# Altium schematic sheet Digital_Inputs.SchDoc
size A4; SheetNumber: 4; SheetTotal: 6
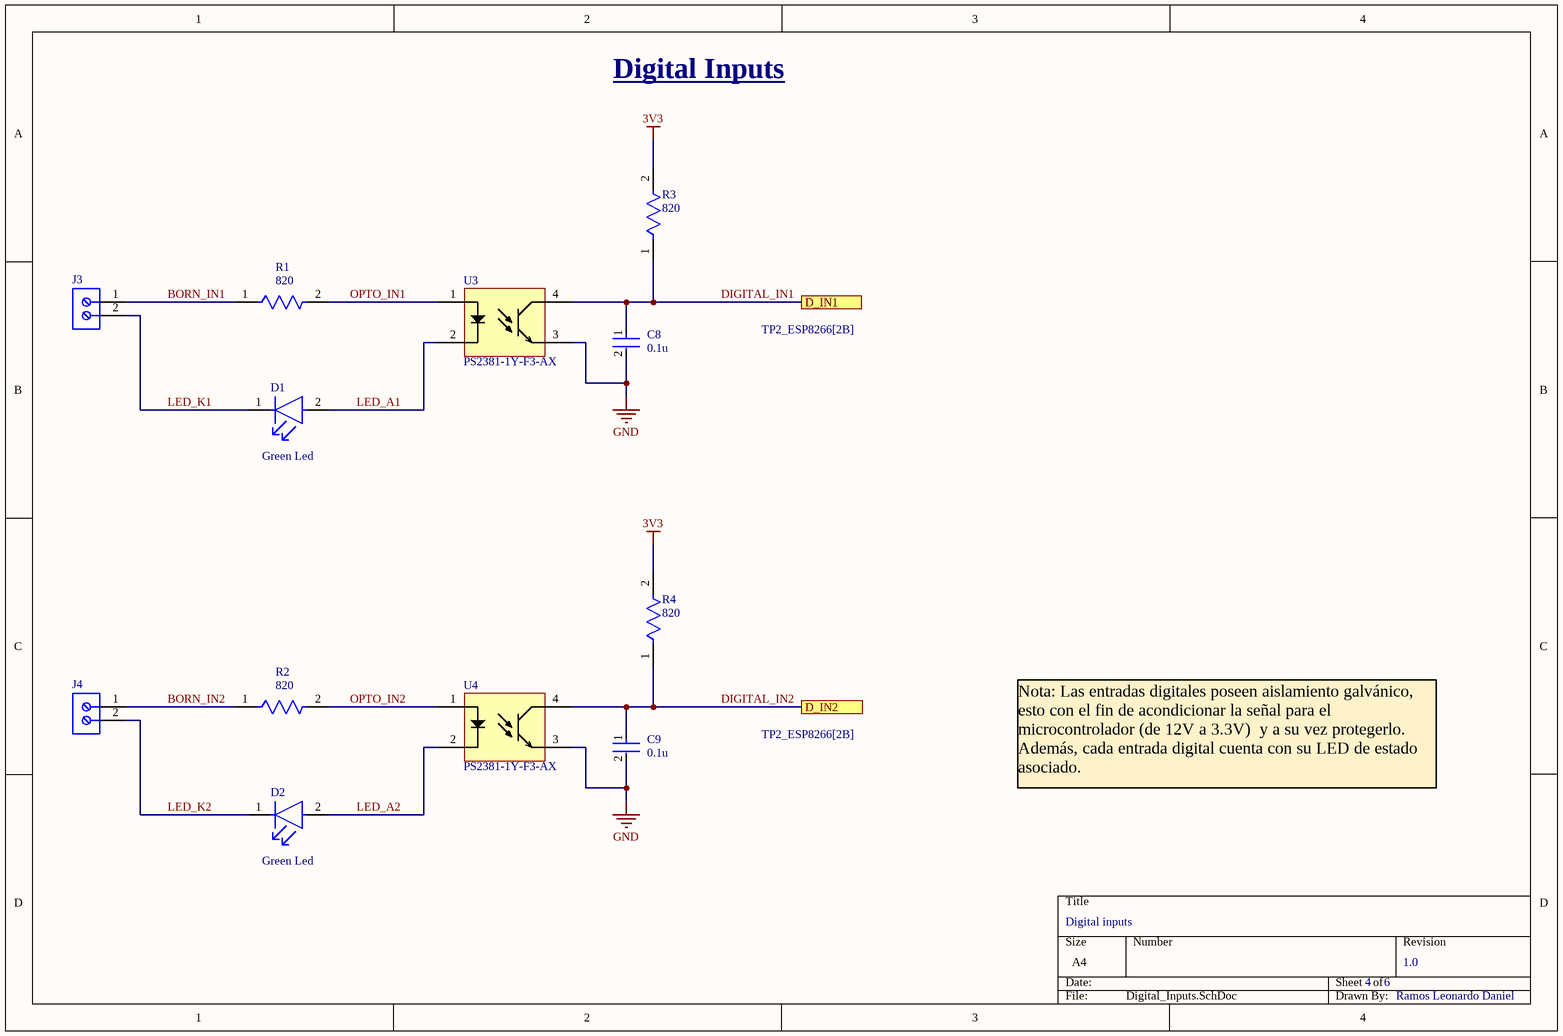
[diagram p0: Digital_Inputs.SchDoc]

## Parts
C8  value 0.1u  [FP-CC0805-0_85-MFG]  (hidden comment: CC0805KRX7R8BB104)
C9  value 0.1u  [FP-CC0805-0_85-MFG]  (hidden comment: CC0805KRX7R8BB104)
D1  Green Led  [FP-LTST-C190GKT-MFG]
D2  Green Led  [FP-LTST-C190GKT-MFG]
J3  691137710002  [691137710002]  (value not drawn)
J4  691137710002  [691137710002]  (value not drawn)
R1  Resistance: 820  [FP-CRCW0805-e3-IPC_B]  (hidden comment: CRCW08054K70JNEA)
R2  Resistance: 820  [FP-CRCW0805-e3-IPC_B]  (hidden comment: CRCW08054K70JNEA)
R3  Resistance: 820  [FP-CRCW0805-e3-IPC_B]  (hidden comment: CRCW08054K70JNEA)
R4  Resistance: 820  [FP-CRCW0805-e3-IPC_B]  (hidden comment: CRCW08054K70JNEA)
U3  PS2381-1Y-F3-AX  [LSOP254P1020X230-4N]
U4  PS2381-1Y-F3-AX  [LSOP254P1020X230-4N]

## Ports
D_IN1 (see TP2_ESP8266[2B]), D_IN2 (see TP2_ESP8266[2B])

## Nets
3V3: R3.2 R4.2
GND: C8.2 C9.2 U3.3(Emitter) U4.3(Emitter)
BORN_IN1: J3.1 R1.1
BORN_IN2: J4.1 R2.1
DIGITAL_IN1: C8.1 R3.1 U3.4(Collector) ; port D_IN1
DIGITAL_IN2: C9.1 R4.1 U4.4(Collector) ; port D_IN2
LED_A1: D1.2(A) U3.2(Cathode)
LED_A2: D2.2(A) U4.2(Cathode)
LED_K1: D1.1(C) J3.2
LED_K2: D2.1(C) J4.2
OPTO_IN1: R1.2 U3.1(Anode)
OPTO_IN2: R2.2 U4.1(Anode)

## Notes on the sheet
- Digital Inputs
- Nota: Las entradas digitales poseen aislamiento galvánico, esto con el fin de acondicionar la señal para el microcontrolador (de 12V a 3.3V)  y a su vez protegerlo. Además, cada entrada digital cuenta con su LED de estado asociado.
- Digital inputs
- 4
- 6
- 1.0
- Ramos Leonardo Daniel

## Library data of the parts
C8 C9 = CMP-1036-04410-2: CAP CER 0.1UF 25V X7R 0805; Manufacturer: Yageo; Tolerance: 0.1; Material: Ceramic; Capacitance: 100 nF; ComponentLink2URL: http://www.yageo.com/documents/recent/UPY-GPHC_Y5V_6.3V-to-50V_8.pdf; Category: Cap; Mouser Description: Multilayer Ceramic Capacitors MLCC - SMD/SMT 100nF 25V X7R 10%; Manufacturer Part Number: CC0805KRX7R8BB104; Device Class L1: Passive Components; Footprint Url: http://www.yageo.com/exep/pages/download/literatures/UPY-C_GEN_24.pdf; Height: 0.95mm; Digikey Description: CAP CER 0.1UF 25V X7R 0805; Lead Free: Yes; Temperature Range High: +85°C; Temperature: -30°C to +85°C; Ipc Land Pattern Name: CAPC200125X85; Automotive: No; Octopart: https://octopart.com/cc0805krx7r8bb104-yageo-39467766; Device Class L2: Capacitors; Temperature Characteristic: X7R; Voltage Rating: 25 V; ComponentLink2Description: Datasheet; Temperature Range Low: -30°C; Device Class L3: Ceramic Capacitors; RoHS: TRUE; Package: CC0805-0.85
D1 D2 = CMP-22017-000005-2: LED GREEN CLEAR CHIP SMD LTST-C190GKT; Dominant Wavelength: 569nm; Reverse Voltage: 5V; Lens Color: Colorless; Viewing Angle: 130°; Voltage: 2V; Forward Current: 30mA; Power Dissipation: 100mW; Luminous Intensity: 6mcd; Number of LEDs: 1; Forward Voltage: 2.1V; Wavelength: 565nm; Test Current: 10mA; Min Operating Temperature: -55°C; Lens Style: Clear; Mount: Surface Mount; Width: 0.8mm; Packaging: Tape and Reel; Lens Transparency: Clear; Case Code (Metric): 1608; Depth: 0.8mm; Case Code (Imperial): 0603; Case/Package: 0603; Number of Pins: 2; Max Operating Temperature: 85°C; Lead Free: Lead Free; Number of Elements: 1; Length: 1.6mm; Height: 0.8mm; Package Quantity: 1; Power Rating: 100mW; Radiation Hardening: No; Illumination Color: Green; Color: Green
J3 J4 = CMP-1502-03324-2: NexarPartId: 78871135; Voltage Rating: 300V; Number of Contacts: 2; Current Rating: 16A; Lead Pitch: 5mm; Height: 11.6mm; Packaging: Box; RoHS: Non-Compliant; Contact Material: Nickel, Tin; Max Operating Temperature: 120°C; Number of Pins: 2; Min Operating Temperature: -30°C; Number of Rows: 1
R1-R4 = CMP-2001-03967-2: RES Thick Film, 4.7kΩ, 5%, 0.125W, 200ppm/°C, 0805; Power Rating: 125mW; Voltage Rating: 150V; Radiation Hardening: No; Case Code (Imperial): 0805; Military Standard: Not; Contact Plating: Tin; Weight: 0.000194oz; Mount: Surface Mount; Termination: SMD/SMT; Packaging: Tape and Reel; Min Operating Temperature: -55°C; Width: 1.25mm; Tolerance: 5%; Height: 0.45mm; Depth: 1.25mm; Length: 2mm; Temperature Coefficient: 200ppm/°C; Case Code (Metric): 2012; Package Quantity: 5000; Max Operating Temperature: 155°C; Case/Package: 0805; Composition: Thick Film
U3 U4 = CMP-00572-25656563-1: PS2381-1Y-F3-AX Optocoupler, Transistor, 5Kv, Lsop-4 Rohs Compliant: Yes; Forward Current: 60mA; Reverse Breakdown Voltage: 6V; Collector Emitter Saturation Voltage: 300mV; Forward Voltage: 1.4V; Current Transfer Ratio: 400%; Number of Elements: 1; Collector Emitter Voltage (VCEO): 80V; Power Dissipation: 250mW; Max Operating Temperature: 115°C; Number of Pins: 4; Mount: Surface Mount; NexarPartId: 25656563; Case/Package: SOP; Min Operating Temperature: -40°C; RoHS: Compliant; Packaging: Tape and Reel